# Altium schematic sheet board.SchDoc
size A
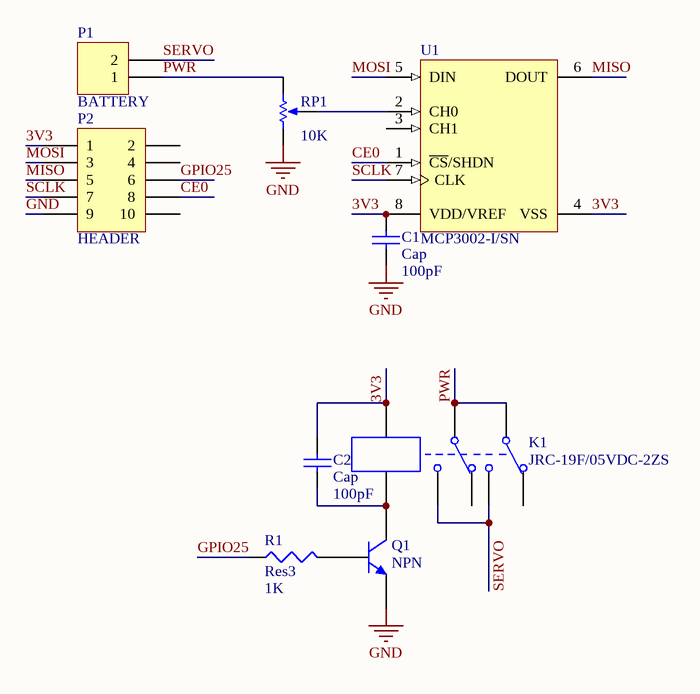
[diagram p0: board.SchDoc]

## Parts
C1  Cap  value 100pF  [C0805]
C2  Cap  value 100pF  [C0805]
K1  JRC-19F/05VDC-2ZS  [Relay-DPDT]
P1  BATTERY  [HDR1X2]
P2  HEADER  [HDR2X5]
Q1  NPN  [TO-226-AA]
R1  Res3  value 1K  [6-0805_L]
RP1  value 10K  [HDR1X3]  (hidden comment: RPot)
U1  MCP3002-I/SN  [SOIC-SN8_N]

## Nets
GND: C1.2 P2.9 Q1.3(E) RP1.1(TOP)
3V3: C1.1 C2.1 K1.1 P2.1 U1.4(VSS) U1.8(VDD/VREF)
CE0: P2.8 U1.1(~{CS}/SHDN)
GPIO25: P2.6 R1.1
MISO: P2.5 U1.6(DOUT)
MOSI: P2.3 U1.5(DIN)
PWR: K1.2 K1.7 P1.1 RP1.2(BOT)
SCLK: P2.7 U1.7(CLK)
SERVO: K1.4 K1.5 P1.2
NetC2_2: C2.2 K1.8 Q1.1(C)
NetQ1_2: Q1.2(B) R1.2
NetRP1_3: RP1.3(TAP) U1.2(CH0)

Not connected (* = marked no-connect by the designer): K1 3 6; P2 2 4 10; U1 3(CH1)

## Library data of the parts
C1 C2 = Cap: Capacitor; Published: 8-Jun-2000; LatestRevisionDate: 17-Jul-2002; LatestRevisionNote: Re-released for DXP Platform.; PackageReference: RAD-0.3; Publisher: Altium Limited; PackageDescription: Radial Cap, Thru-Hole; 2 Leads; 0.3 in Pin Spacing
K1 = Relay-DPDT
P1 = Header 2: Header, 2-Pin; LatestRevisionDate: 17-Jul-2002; LatestRevisionNote: Re-released for DXP Platform.; Publisher: Altium Limited
P2 = Header 5X2: Header, 5-Pin, Dual row; LatestRevisionDate: 17-Jul-2002; LatestRevisionNote: Re-released for DXP Platform.; Publisher: Altium Limited
Q1 = NPN: NPN Bipolar Transistor; Published: 8-Jun-2000; LatestRevisionDate: 17-Jul-2002; LatestRevisionNote: Re-released for DXP Platform.; PackageReference: TO-226-AA; Publisher: Altium Limited; PackageDescription: TO, Flat Index; 3 In-Line, Axial Leads; Body Dia. 4.8mm; Leads 0.55 x 0.51 mm (max); Code_JEDEC: TO-226-AA
R1 = Res3: Resistor; Published: 8-Jun-2000; LatestRevisionDate: 29-May-2009; LatestRevisionNote: IPC-7351 Footprint Added.; PackageReference: J1-0603; Publisher: Altium Limited; PackageDescription: Chip Resistor
RP1 = RPot: Potentiometer; pin to pad: 1>3 2>1 3>2; Sim Note: Enter the Resistance value and the set point into parameter fields.; Set Position: 0.5; Published: 8-Jun-2000; LatestRevisionDate: 17-Jul-2002; LatestRevisionNote: Re-released for DXP Platform.; PackageReference: VR5; Publisher: Altium Limited; PackageDescription: Variable Resistor, Thru-Hole; 3 Leads
U1 = MCP3002-I/SN: 2.7V Dual Channel 10-Bit A/D Converter with SPI Serial Interface, 8-Pin SOIC 150mil, Industrial Temperature; Published: 29-Jan-2009; LatestRevisionDate: 02-Dec-2009; LatestRevisionNote: Updated to datasheet revision D, Oct-2008; DatasheetVersion: revD, Oct-2008; PackageVersion: revBB, Aug-2009; PackageReference: SOIC-SN8; Publisher: Altium Limited; PackageDescription: 8-Lead Plastic Small Outline (SN) - Narrow, 3.90mm Body [SOIC]; Supplier 1: Digi-Key; Supplier Part Number 1: MCP3002-I/SN-ND; Supplier 2: Farnell; Supplier Part Number 2: 1040700; Supplier 3: Farnell; Supplier Part Number 3: 1834969; Code_JEDEC: MS-012; Code_IPC: SOIC127P600-8; ComponentLink1Description: Datasheet; ComponentLink1URL: http://ww1.microchip.com/downloads/en/DeviceDoc/21294d.pdf; ComponentLink2Description: Packaging Specification; ComponentLink2URL: http://www.microchip.com/stellent/groups/techpub_sg/documents/packagingspec/en012702.pdf; ComponentLink3Description: Microchip.com Home; ComponentLink3URL: http://www.microchip.com/